# Altium project PMSM_LCP037.PrjPcb
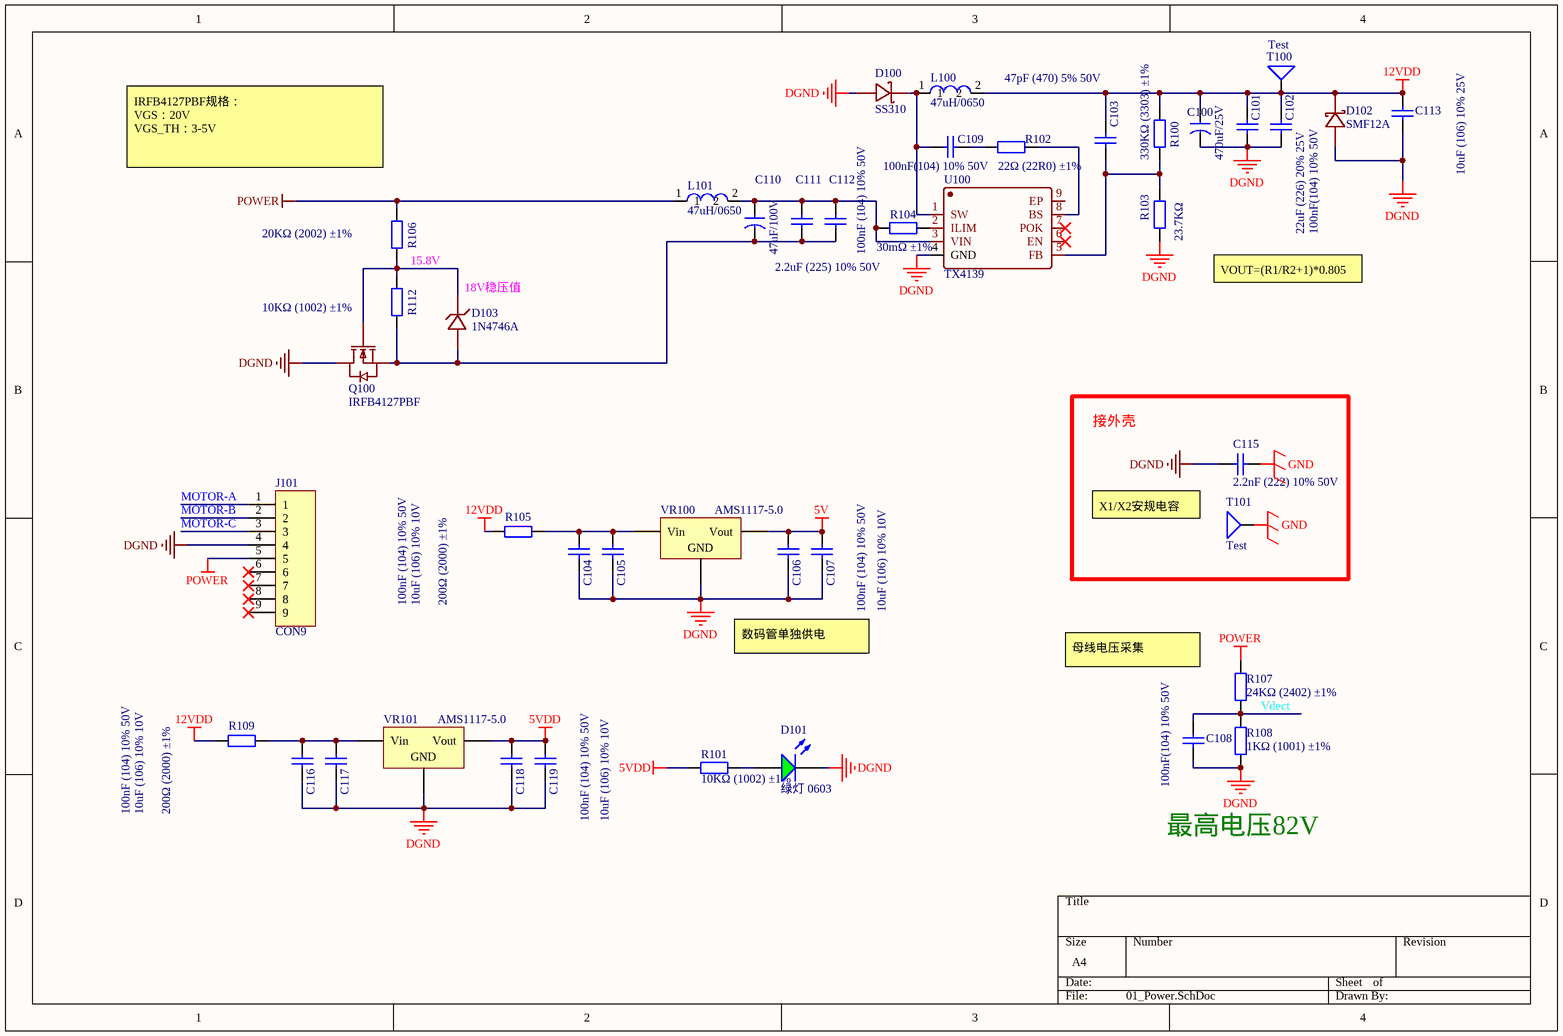
[diagram p0: 01_Power.SchDoc]
3 sheets, 104 parts. Net scope: global (net labels, ports and power ports of the same name join across sheets).
Board file: PMSM_LCP037_V0.1.PcbDoc
Sheets:
  01_Power.SchDoc
  02_MCU.SchDoc
  03_Mos.SchDoc

## Sheet 01_Power.SchDoc
size A4

### Parts
C100  470uF/25V  [47UF/100V]
C101  22uF (226) 20% 25V  [0805_C]
C102  100nF(104) 10% 50V  [0805_C]
C103  47pF (470) 5% 50V  [0805_C]
C104  100nF (104) 10% 50V  [0603_C]
C105  10uF (106) 10% 10V  [0603_C]
C106  100nF (104) 10% 50V  [0603_C]
C107  10uF (106) 10% 10V  [0603_C]
C108  100nF(104) 10% 50V  [0805_C]
C109  100nF(104) 10% 50V  [0805_C]
C110  47uF/100V  [47UF/100V]
C111  2.2uF (225) 10% 50V  [1206_C]
C112  100nF (104) 10% 50V  [1206_C]
C113  10uF (106) 10% 25V  [0805_C]
C115  2.2nF (222) 10% 50V  [X1/Y1 500V]
C116  100nF (104) 10% 50V  [0603_C]
C117  10uF (106) 10% 10V  [0603_C]
C118  100nF (104) 10% 50V  [0603_C]
C119  10uF (106) 10% 10V  [0603_C]
D100  SS310  [SS310]
D101  绿灯 0603  [0603_LED_S1]
D102  SMF12A  [SMF12A - duplicate]
D103  1N4746A  [1N4746A]
J101  CON9  [CON9 9.5mm]
L100  47uH/0650  [0650_47uH]
L101  47uH/0650  [0650_47uH]
Q100  IRFB4127PBF  [IRFB4127]
R100  330KΩ (3303) ±1%  [0805_R]
R101  10KΩ (1002) ±1%  [0603_R]
R102  22Ω (22R0) ±1%  [0805_R]
R103  23.7KΩ  [0805_R]
R104  30mΩ ±1%  [0603_R]
R105  200Ω (2000) ±1%  [1206_R]
R106  20KΩ (2002) ±1%  [0805_R]
R107  24KΩ (2402) ±1%  [1206_R]
R108  1KΩ (1001) ±1%  [0805_R]
R109  200Ω (2000) ±1%  [1206_R]
R112  10KΩ (1002) ±1%  [0805_R]
T100  Test  [Testpoint]
T101  Test  [接地螺丝孔]
U100  TX4139  [ESOP8]
VR100  AMS1117-5.0  [SOT-223]
VR101  AMS1117-5.0  [SOT-223]

### Blocks framed on the sheet
接外壳: C115 T101

### Nets
5V: C106.2 C107.2 VR100.2(Vout)
5VDD: C118.2 C119.2 R101.2 VR101.2(Vout)
12VDD: C100.1 C101.2 C102.2 C103.2 C113.1 D102.1(K) L100.2 R100.2 R105.1 R109.1 T100.1
DGND: C100.2 C101.1 C102.1 C104.1 C105.1 C106.1 C107.1 C108.1 C113.2 C115.1 C116.1 C117.1 C118.1 C119.1 D100.2(A) D101.K D102.2(A) J101.4 Q100.2(D) R103.1 R108.1 U100.4(GND) VR100.1(GND) VR101.1(GND)
GND: C115.2 T101.1
POWER: J101.5 L101.1 R106.2 R107.2
MOTOR-A: J101.1
MOTOR-B: J101.2
MOTOR-C: J101.3
Vdect: C108.2 R107.1 R108.2
NetC103_1: C103.1 R100.1 R103.2 U100.5(FB)
NetC104_2: C104.2 C105.2 R105.2 VR100.3(Vin)
NetC109_1: C109.1 D100.1(K) L100.1 U100.1(SW)
NetC109_2: C109.2 R102.1
NetC110_1: C110.1 C111.2 C112.2 L101.2 R104.2 U100.3(VIN)
NetC110_2: C110.2 C111.1 C112.1 D103.1(A) Q100.3(S) R112.1
NetC116_2: C116.2 C117.2 R109.2 VR101.3(Vin)
NetD101_A: D101.A R101.1
NetD103_2: D103.2(K) Q100.1(G) R106.1 R112.2
NetR102_2: R102.2 U100.8(BS)
NetR104_1: R104.1 U100.2(ILIM)

Not connected (* = marked no-connect by the designer): J101 6* 7* 8* 9*; U100 6(EN)* 7(POK)* 9(EP)

### Notes on the sheet
- IRFB4127PBF规格：
  VGS：20V
  VGS_TH：3-5V
- 15.8V
- (near D103) 18V稳压值
- VOUT=(R1/R2+1)*0.805
- X1/X2安规电容
- 数码管单独供电
- (near R107) 母线电压采集
- 最高电压82V

### Library data of the parts
C100 C110 = CapSMT220u_16V
C101 = 0805 22uF (226) 20% 25V: 贴片电容; ComponentLink1Description: 供应商链接; ComponentLink1URL: http://www.szlcsc.com/product/details_46786.html; Package: 0805; Supplier: LC; SuppliersPartNumber: C45783
C102 C108 C109 = 0805 100nF(104) 10% 50V: 贴片电容; ComponentLink1Description: 供应商链接; ComponentLink1URL: http://www.szlcsc.com/product/details_50686.html; Package: 0805; Supplier: LC; SuppliersPartNumber: C49678
C103 = 0805 47pF (470) 5% 50V: 贴片电容; ComponentLink1Description: 供应商链接; ComponentLink1URL: http://www.szlcsc.com/product/details_15529.html; Package: 0805; Supplier: LC; SuppliersPartNumber: C14857
C104 C106 C116 C118 = 0603 100nF (104) 10% 50V: 贴片电容; ComponentLink1Description: 供应商链接; ComponentLink1URL: http://www.szlcsc.com/product/details_15331.html; Package: 0603; Supplier: LC; SuppliersPartNumber: C14663
C105 C107 C117 C119 = 0603 10uF (106) 10% 10V: 贴片电容; ComponentLink1Description: 供应商链接; ComponentLink1URL: http://www.szlcsc.com/product/details_20411.html; Package: 0603; Supplier: LC; SuppliersPartNumber: C19702
C111 = 1206 2.2uF (225) 10% 50V: 贴片电容; ComponentLink1Description: 供应商链接; ComponentLink1URL: http://www.szlcsc.com/product/details_13292.html; Package: 1206; Supplier: LC; SuppliersPartNumber: C12656
C112 = 1206 100nF (104) 10% 50V: 贴片电容; ComponentLink1Description: 供应商链接; ComponentLink1URL: http://www.szlcsc.com/product/details_25237.html; Package: 1206; Supplier: LC; SuppliersPartNumber: C24497
C113 = 0805 10uF (106) 10% 25V: 贴片电容; ComponentLink1Description: 供应商链接; ComponentLink1URL: http://www.szlcsc.com/product/details_16532.html; Package: 0805; Supplier: LC; SuppliersPartNumber: C15850
C115 = 0603 2.2nF (222) 10% 50V: 贴片电容; ComponentLink1Description: 供应商链接; ComponentLink1URL: http://www.szlcsc.com/product/details_1956.html; Package: 0603; Supplier: LC; SuppliersPartNumber: C1604
D101 = 0603 绿灯: 发光二极管; ComponentLink1Description: 供应商链接; ComponentLink1URL: http://www.szlcsc.com/product/details_73152.html; Package: 0603; Supplier: LC; SuppliersPartNumber: C72043
L100 L101 = Inductor
R100 = 0805 330KΩ (3303) 1%: 贴片电阻; ComponentLink1Description: 供应商链接; ComponentLink1URL: http://www.szlcsc.com/product/details_18317.html; Package: 0805; Supplier: LC; SuppliersPartNumber: C17629
R101 = 0603 10KΩ (1002) 1%: 贴片电阻; ComponentLink1Description: 供应商链接; ComponentLink1URL: http://www.szlcsc.com/product/details_26547.html; Package: 0603; Supplier: LC; SuppliersPartNumber: C25804
R102 R103 = 0805 22Ω (22R0) 1%: 贴片电阻; ComponentLink1Description: 供应商链接; ComponentLink1URL: http://www.szlcsc.com/product/details_18249.html; Package: 0805; Supplier: LC; SuppliersPartNumber: C17561
R104 = 0603 100KΩ (1003) 1%: 贴片电阻; ComponentLink1Description: 供应商链接; ComponentLink1URL: http://www.szlcsc.com/product/details_26546.html; Package: 0603; Supplier: LC; SuppliersPartNumber: C25803
R105 R109 = 1206 300Ω (3000) 1%: 贴片电阻; ComponentLink1Description: 供应商链接; ComponentLink1URL: http://www.szlcsc.com/product/details_18575.html; Package: 1206; Supplier: LC; SuppliersPartNumber: C17887
R106 = 0805 20KΩ (2002) 1%: 贴片电阻; ComponentLink1Description: 供应商链接; ComponentLink1URL: http://www.szlcsc.com/product/details_4735.html; Package: 0805; Supplier: LC; SuppliersPartNumber: C4328
R107 = 1206 0Ω (0R0) 1%: 贴片电阻; ComponentLink1Description: 供应商链接; ComponentLink1URL: http://www.szlcsc.com/product/details_18576.html; Package: 1206; Supplier: LC; SuppliersPartNumber: C17888
R108 = 0805 1KΩ (1001) 1%: 贴片电阻; ComponentLink1Description: 供应商链接; ComponentLink1URL: http://www.szlcsc.com/product/details_18201.html; Package: 0805; Supplier: LC; SuppliersPartNumber: C17513
R112 = 0805 10KΩ (1002) 1%: 贴片电阻; ComponentLink1Description: 供应商链接; ComponentLink1URL: http://www.szlcsc.com/product/details_18102.html; Package: 0805; Supplier: LC; SuppliersPartNumber: C17414
T100 T101 = TestPad
VR100 VR101 = SOT-223 AMS1117-5.0: 低压差线性稳压(LDO); ComponentLink1Description: 供应商链接; ComponentLink1URL: http://www.szlcsc.com/product/details_6653.html; Package: SOT-223; Supplier: LC; SuppliersPartNumber: C6187

## Sheet 02_MCU.SchDoc
size A4
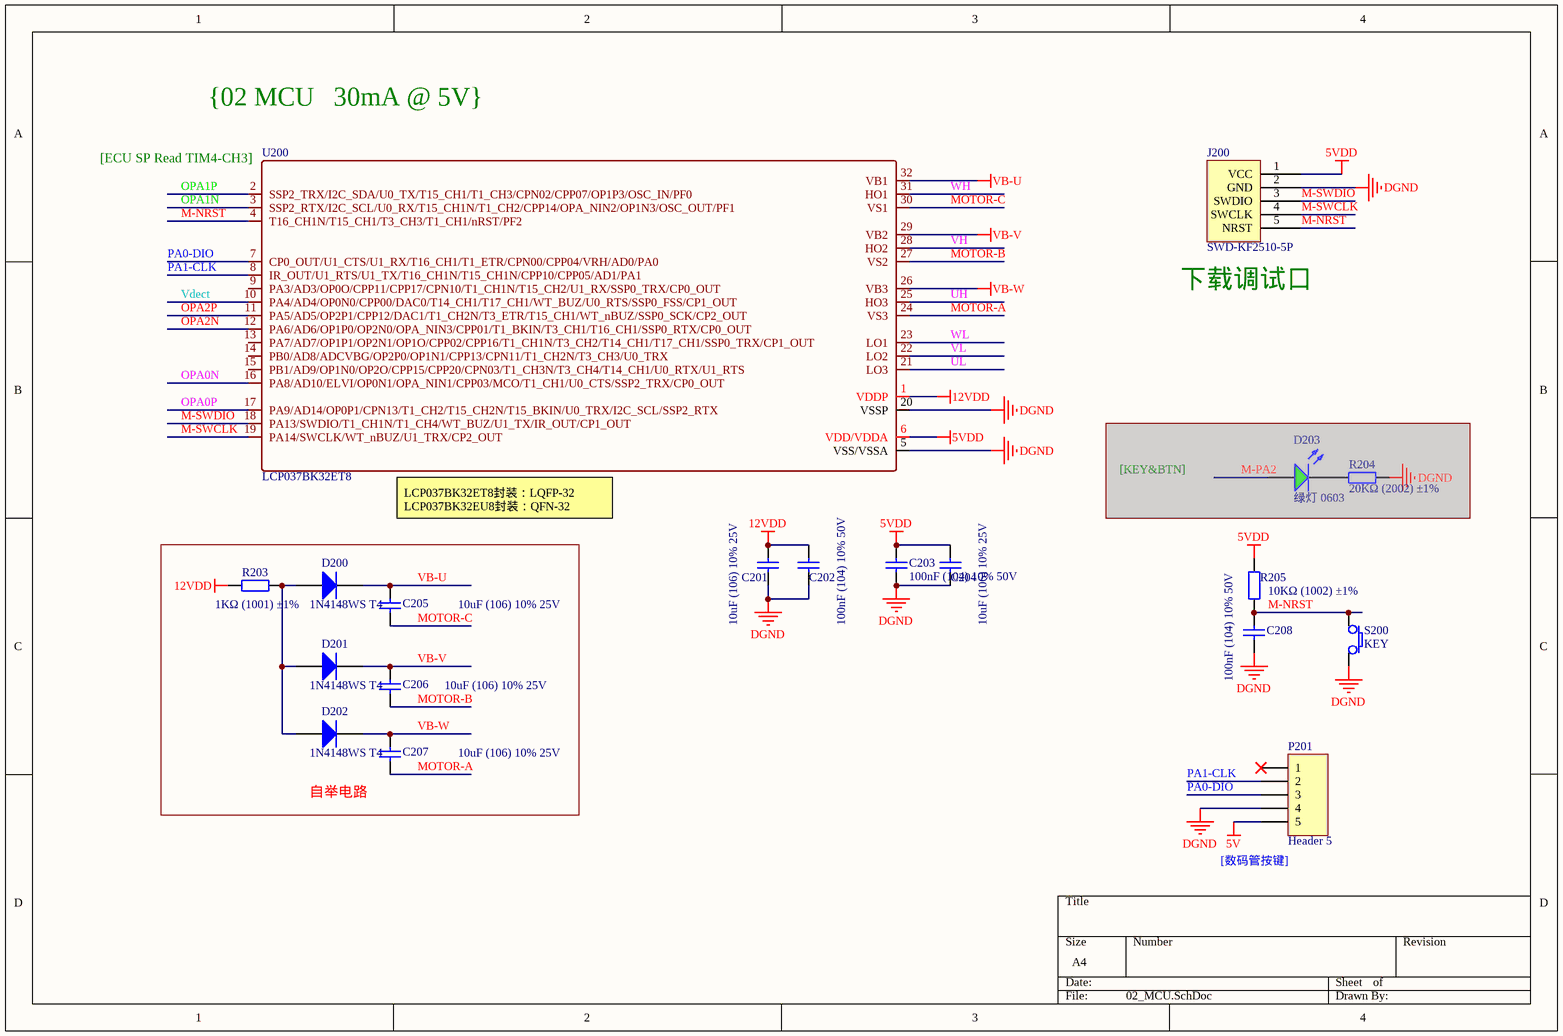
[diagram p1: 02_MCU.SchDoc]

### Parts
C201  10uF (106) 10% 25V  [0805_C]
C202  100nF (104) 10% 50V  [0603_C]
C203  100nF (104) 10% 50V  [0603_C]
C204  10uF (106) 10% 25V  [0805_C]
C205  10uF (106) 10% 25V  [0805_C]
C206  10uF (106) 10% 25V  [0805_C]
C207  10uF (106) 10% 25V  [0805_C]
C208  100nF (104) 10% 50V  [0603_C]
D200  1N4148WS T4  [SOD-323]
D201  1N4148WS T4  [SOD-323]
D202  1N4148WS T4  [SOD-323]
D203  绿灯 0603  [LC-0603_LED_S1]  (masked out: inside a compile mask, not in the netlist)
J200  SWD-KF2510-5P  [XH2.54-5P]
P201  Header 5  [XH2.54-5P]
R203  1KΩ (1001) ±1%  [0805_R]
R204  20KΩ (2002) ±1%  [LC-0603_R]  (masked out: inside a compile mask, not in the netlist)
R205  10KΩ (1002) ±1%  [0603_R]
S200  KEY  [按键3*4]
U200  LCP037BK32ET8  [LQFP32]

### Blocks framed on the sheet
自举电路: C205-C207 D200-D202 R203

### Nets
5V: P201.5
5VDD: C203.2 C204.2 J200.1(VCC) R205.2 U200.6(VDD/VDDA)
12VDD: C201.2 C202.2 R203.1 U200.1(VDDP)
DGND: C201.1 C202.1 C203.1 C204.1 C208.1 J200.2(GND) P201.4 S200.2 U200.5(VSS/VSSA) U200.20(VSSP)
VB-U: C205.2 D200.2(K) U200.32(VB1)
VB-V: C206.2 D201.2(K) U200.29(VB2)
VB-W: C207.2 D202.2(K) U200.26(VB3)
M-NRST: C208.2 J200.5(NRST) R205.1 S200.1 U200.4(T16_CH1N/T15_CH1/T3_CH3/T1_CH1/nRST/PF2)
M-SWCLK: J200.4(SWCLK) U200.19(PA14/SWCLK/WT_nBUZ/U1_TRX/CP2_OUT)
M-SWDIO: J200.3(SWDIO) U200.18(PA13/SWDIO/T1_CH1N/T1_CH4/WT_BUZ/U1_TX/IR_OUT/CP1_OUT)
MOTOR-A: C207.1 U200.24(VS3)
MOTOR-B: C206.1 U200.27(VS2)
MOTOR-C: C205.1 U200.30(VS1)
OPA0N: U200.16(PA8/AD10/ELVI/OP0N1/OPA_NIN1/CPP03/MCO/T1_CH1/U0_CTS/SSP2_TRX/CP0_OUT)
OPA0P: U200.17(PA9/AD14/OP0P1/CPN13/T1_CH2/T15_CH2N/T15_BKIN/U0_TRX/I2C_SCL/SSP2_RTX)
OPA1N: U200.3(SSP2_RTX/I2C_SCL/U0_RX/T15_CH1N/T1_CH2/CPP14/OPA_NIN2/OP1N3/OSC_OUT/PF1)
OPA1P: U200.2(SSP2_TRX/I2C_SDA/U0_TX/T15_CH1/T1_CH3/CPN02/CPP07/OP1P3/OSC_IN/PF0)
OPA2N: U200.12(PA6/AD6/OP1P0/OP2N0/OPA_NIN3/CPP01/T1_BKIN/T3_CH1/T16_CH1/SSP0_RTX/CP0_OUT)
OPA2P: U200.11(PA5/AD5/OP2P1/CPP12/DAC1/T1_CH2N/T3_ETR/T15_CH1/WT_nBUZ/SSP0_SCK/CP2_OUT)
PA0-DIO: P201.3 U200.7(CP0_OUT/U1_CTS/U1_RX/T16_CH1/T1_ETR/CPN00/CPP04/VRH/AD0/PA0)
PA1-CLK: P201.2 U200.8(IR_OUT/U1_RTS/U1_TX/T16_CH1N/T15_CH1N/CPP10/CPP05/AD1/PA1)
UH: U200.25(HO3)
UL: U200.21(LO3)
Vdect: U200.10(PA4/AD4/OP0N0/CPP00/DAC0/T14_CH1/T17_CH1/WT_BUZ/U0_RTS/SSP0_FSS/CP1_OUT)
VH: U200.28(HO2)
VL: U200.22(LO2)
WH: U200.31(HO1)
WL: U200.23(LO1)
NetD200_1: D200.1(A) D201.1(A) D202.1(A) R203.2

Not connected (* = marked no-connect by the designer): P201 1*; U200 9(PA3/AD3/OP0O/CPP11/CPP17/CPN10/T1_CH1N/T15_CH2/U1_RX/SSP0_TRX/CP0_OUT) 13(PA7/AD7/OP1P1/OP2N1/OP1O/CPP02/CPP16/T1_CH1N/T3_CH2/T14_CH1/T17_CH1/SSP0_TRX/CP1_OUT) 14(PB0/AD8/ADCVBG/OP2P0/OP1N1/CPP13/CPN11/T1_CH2N/T3_CH3/U0_TRX) 15(PB1/AD9/OP1N0/OP2O/CPP15/CPP20/CPN03/T1_CH3N/T3_CH4/T14_CH1/U0_RTX/U1_RTS)

### Notes on the sheet
- {02 MCU   30mA @ 5V}
- (near U200) [ECU SP Read TIM4-CH3]
- (near J200) 下载调试口
- (near U200) LCP037BK32ET8封装：LQFP-32
  LCP037BK32EU8封装：QFN-32
- [KEY&BTN]
- (near P201) [数码管按键]

### Library data of the parts
C201 C204-C207 = 0805 10uF (106) 10% 25V: 贴片电容; ComponentLink1Description: 供应商链接; ComponentLink1URL: http://www.szlcsc.com/product/details_16532.html; Package: 0805; Supplier: LC; SuppliersPartNumber: C15850
C202 C203 C208 = 0603 100nF (104) 10% 50V: 贴片电容; ComponentLink1Description: 供应商链接; ComponentLink1URL: http://www.szlcsc.com/product/details_15331.html; Package: 0603; Supplier: LC; SuppliersPartNumber: C14663
D200-D202 = SOD-323 1N4148WS T4: 二极管; ComponentLink1Description: 供应商链接; ComponentLink1URL: http://www.szlcsc.com/product/details_2485.html; Package: SOD-323; Supplier: LC; SuppliersPartNumber: C2128
D203 = 0603 绿灯: 发光二极管; ComponentLink1Description: 供应商链接; ComponentLink1URL: http://www.szlcsc.com/product/details_73152.html; Package: 0603; Supplier: LC; SuppliersPartNumber: C72043
J200 = ST-LINK-SWD
P201 = Header 5: Header, 5-Pin; LatestRevisionDate: 17-Jul-2002; LatestRevisionNote: Re-released for DXP Platform.; Publisher: Altium Limited
R203 = 0805 1KΩ (1001) 1%: 贴片电阻; ComponentLink1Description: 供应商链接; ComponentLink1URL: http://www.szlcsc.com/product/details_18201.html; Package: 0805; Supplier: LC; SuppliersPartNumber: C17513
R204 = 0603 20KΩ (2002) 1%: 贴片电阻; ComponentLink1Description: 供应商链接; ComponentLink1URL: http://www.szlcsc.com/product/details_4591.html; Package: 0603; Supplier: LC; SuppliersPartNumber: C4184
R205 = 0603 10KΩ (1002) 1%: 贴片电阻; ComponentLink1Description: 供应商链接; ComponentLink1URL: http://www.szlcsc.com/product/details_26547.html; Package: 0603; Supplier: LC; SuppliersPartNumber: C25804
U200 = LCP037BT32EU8

## Sheet 03_Mos.SchDoc
size A4
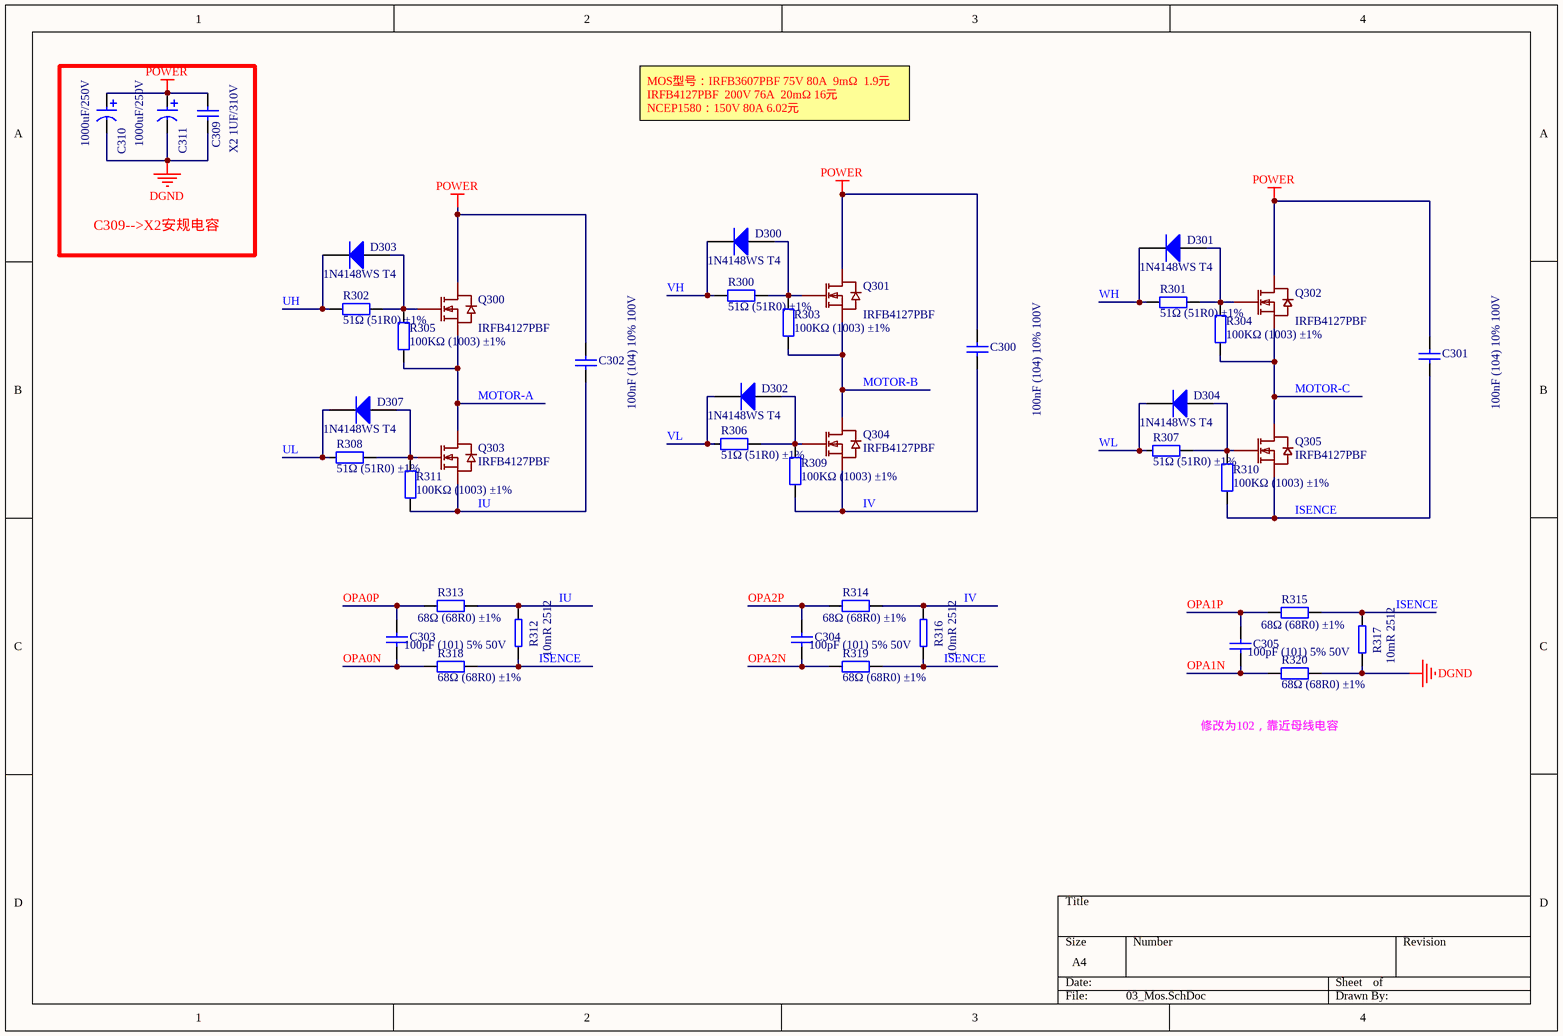
[diagram p2: 03_Mos.SchDoc]

### Parts
C300  100nF (104) 10% 100V  [1206_C]
C301  100nF (104) 10% 100V  [1206_C]
C302  100nF (104) 10% 100V  [1206_C]
C303  100pF (101) 5% 50V  [0805_C]
C304  100pF (101) 5% 50V  [0805_C]
C305  100pF (101) 5% 50V  [0805_C]
C309  X2 1UF/310V  [X2 1UF 310V]
C310  1000uF/250V  [1000uf/250V]
C311  1000uF/250V  [1000uf/250V]
D300  1N4148WS T4  [SOD-323]
D301  1N4148WS T4  [SOD-323]
D302  1N4148WS T4  [SOD-323]
D303  1N4148WS T4  [SOD-323]
D304  1N4148WS T4  [SOD-323]
D307  1N4148WS T4  [SOD-323]
Q300  IRFB4127PBF  [IRFB4127]
Q301  IRFB4127PBF  [IRFB4127]
Q302  IRFB4127PBF  [IRFB4127]
Q303  IRFB4127PBF  [IRFB4127]
Q304  IRFB4127PBF  [IRFB4127]
Q305  IRFB4127PBF  [IRFB4127]
R300  51Ω (51R0) ±1%  [0805_R]
R301  51Ω (51R0) ±1%  [0805_R]
R302  51Ω (51R0) ±1%  [0805_R]
R303  100KΩ (1003) ±1%  [0805_R]
R304  100KΩ (1003) ±1%  [0805_R]
R305  100KΩ (1003) ±1%  [0805_R]
R306  51Ω (51R0) ±1%  [0805_R]
R307  51Ω (51R0) ±1%  [0805_R]
R308  51Ω (51R0) ±1%  [0805_R]
R309  100KΩ (1003) ±1%  [0805_R]
R310  100KΩ (1003) ±1%  [0805_R]
R311  100KΩ (1003) ±1%  [0805_R]
R312  10mR 2512  [R2512]
R313  68Ω (68R0) ±1%  [0805_R]
R314  68Ω (68R0) ±1%  [0805_R]
R315  68Ω (68R0) ±1%  [0805_R]
R316  10mR 2512  [R2512]
R317  10mR 2512  [R2512]
R318  68Ω (68R0) ±1%  [0805_R]
R319  68Ω (68R0) ±1%  [0805_R]
R320  68Ω (68R0) ±1%  [0805_R]

### Blocks framed on the sheet
C309-->X2安规电容: C309-C311

### Nets
DGND: C309.1 C310.2 C311.2 R317.1 R320.2
POWER: C300.2 C301.2 C302.2 C309.2 C310.1 C311.1 Q300.2(D) Q301.2(D) Q302.2(D)
ISENCE: C301.1 Q305.3(S) R310.1 R312.1 R315.2 R316.1 R317.2 R318.2 R319.2
IU: C302.1 Q303.3(S) R311.1 R312.2 R313.2
IV: C300.1 Q304.3(S) R309.1 R314.2 R316.2
MOTOR-A: Q300.3(S) Q303.2(D) R305.1
MOTOR-B: Q301.3(S) Q304.2(D) R303.1
MOTOR-C: Q302.3(S) Q305.2(D) R304.1
OPA0N: C303.1 R318.1
OPA0P: C303.2 R313.1
OPA1N: C305.1 R320.1
OPA1P: C305.2 R315.1
OPA2N: C304.1 R319.1
OPA2P: C304.2 R314.1
UH: D303.2(K) R302.1
UL: D307.2(K) R308.1
VH: D300.2(K) R300.1
VL: D302.2(K) R306.1
WH: D301.2(K) R301.1
WL: D304.2(K) R307.1
NetD300_1: D300.1(A) Q301.1(G) R300.2 R303.2
NetD301_1: D301.1(A) Q302.1(G) R301.2 R304.2
NetD302_1: D302.1(A) Q304.1(G) R306.2 R309.2
NetD303_1: D303.1(A) Q300.1(G) R302.2 R305.2
NetD304_1: D304.1(A) Q305.1(G) R307.2 R310.2
NetD307_1: D307.1(A) Q303.1(G) R308.2 R311.2

### Notes on the sheet
- MOS型号：IRFB3607PBF 75V 80A  9mΩ  1.9元   IRFB4127PBF  200V 76A  20mΩ 16元      NCEP1580：150V 80A 6.02元
- 修改为102，靠近母线电容

### Library data of the parts
C300-C302 C309 = 1206 100nF (104) 10% 50V: 贴片电容; ComponentLink1Description: 供应商链接; ComponentLink1URL: http://www.szlcsc.com/product/details_25237.html; Package: 1206; Supplier: LC; SuppliersPartNumber: C24497
C303-C305 = 0805 100pF (101) 5% 50V: 贴片电容; ComponentLink1Description: 供应商链接; ComponentLink1URL: http://www.szlcsc.com/product/details_2142.html; Package: 0805; Supplier: LC; SuppliersPartNumber: C1790
C310 C311 = CAP2: 电解电容
D300-D304 D307 = SOD-323 1N4148WS T4: 二极管; ComponentLink1Description: 供应商链接; ComponentLink1URL: http://www.szlcsc.com/product/details_2485.html; Package: SOD-323; Supplier: LC; SuppliersPartNumber: C2128
R300-R302 R306-R308 = 0805 51Ω (51R0) 1%: 贴片电阻; ComponentLink1Description: 供应商链接; ComponentLink1URL: http://www.szlcsc.com/product/details_18426.html; Package: 0805; Supplier: LC; SuppliersPartNumber: C17738
R303-R305 R309-R311 = 0805 100KΩ (1003) 1%: 贴片电阻; ComponentLink1Description: 供应商链接; ComponentLink1URL: http://www.szlcsc.com/product/details_18095.html; Package: 0805; Supplier: LC; SuppliersPartNumber: C17407
R312 R316 R317 = Res10K
R313-R315 R318-R320 = 0805 68Ω (68R0) 1%: 贴片电阻; ComponentLink1Description: 供应商链接; ComponentLink1URL: http://www.szlcsc.com/product/details_18490.html; Package: 0805; Supplier: LC; SuppliersPartNumber: C17802

## Nets that join several sheets
5V: 01_Power (C106.2 C107.2 VR100.2), 02_MCU (P201.5)
5VDD: 01_Power (C118.2 C119.2 R101.2 VR101.2), 02_MCU (5 pins)
12VDD: 01_Power (11 pins), 02_MCU (C201.2 C202.2 R203.1 U200.1)
DGND: 01_Power (24 pins), 02_MCU (10 pins), 03_Mos (5 pins)
POWER: 01_Power (J101.5 L101.1 R106.2 R107.2), 03_Mos (9 pins)
MOTOR-A: 01_Power (J101.1), 02_MCU (C207.1 U200.24), 03_Mos (Q300.3 Q303.2 R305.1)
MOTOR-B: 01_Power (J101.2), 02_MCU (C206.1 U200.27), 03_Mos (Q301.3 Q304.2 R303.1)
MOTOR-C: 01_Power (J101.3), 02_MCU (C205.1 U200.30), 03_Mos (Q302.3 Q305.2 R304.1)
OPA0N: 02_MCU (U200.16), 03_Mos (C303.1 R318.1)
OPA0P: 02_MCU (U200.17), 03_Mos (C303.2 R313.1)
OPA1N: 02_MCU (U200.3), 03_Mos (C305.1 R320.1)
OPA1P: 02_MCU (U200.2), 03_Mos (C305.2 R315.1)
OPA2N: 02_MCU (U200.12), 03_Mos (C304.1 R319.1)
OPA2P: 02_MCU (U200.11), 03_Mos (C304.2 R314.1)
UH: 02_MCU (U200.25), 03_Mos (D303.2 R302.1)
UL: 02_MCU (U200.21), 03_Mos (D307.2 R308.1)
Vdect: 01_Power (C108.2 R107.1 R108.2), 02_MCU (U200.10)
VH: 02_MCU (U200.28), 03_Mos (D300.2 R300.1)
VL: 02_MCU (U200.22), 03_Mos (D302.2 R306.1)
WH: 02_MCU (U200.31), 03_Mos (D301.2 R301.1)
WL: 02_MCU (U200.23), 03_Mos (D304.2 R307.1)